# Altium schematic sheet Input_amplifiers.SchDoc: Input signal amplifiers
size A4; Date: 6.4.2015; Engineer: Matjaž Tome; Revision: B; SheetNumber: 7; SheetTotal: 10; Project: USB DAQ
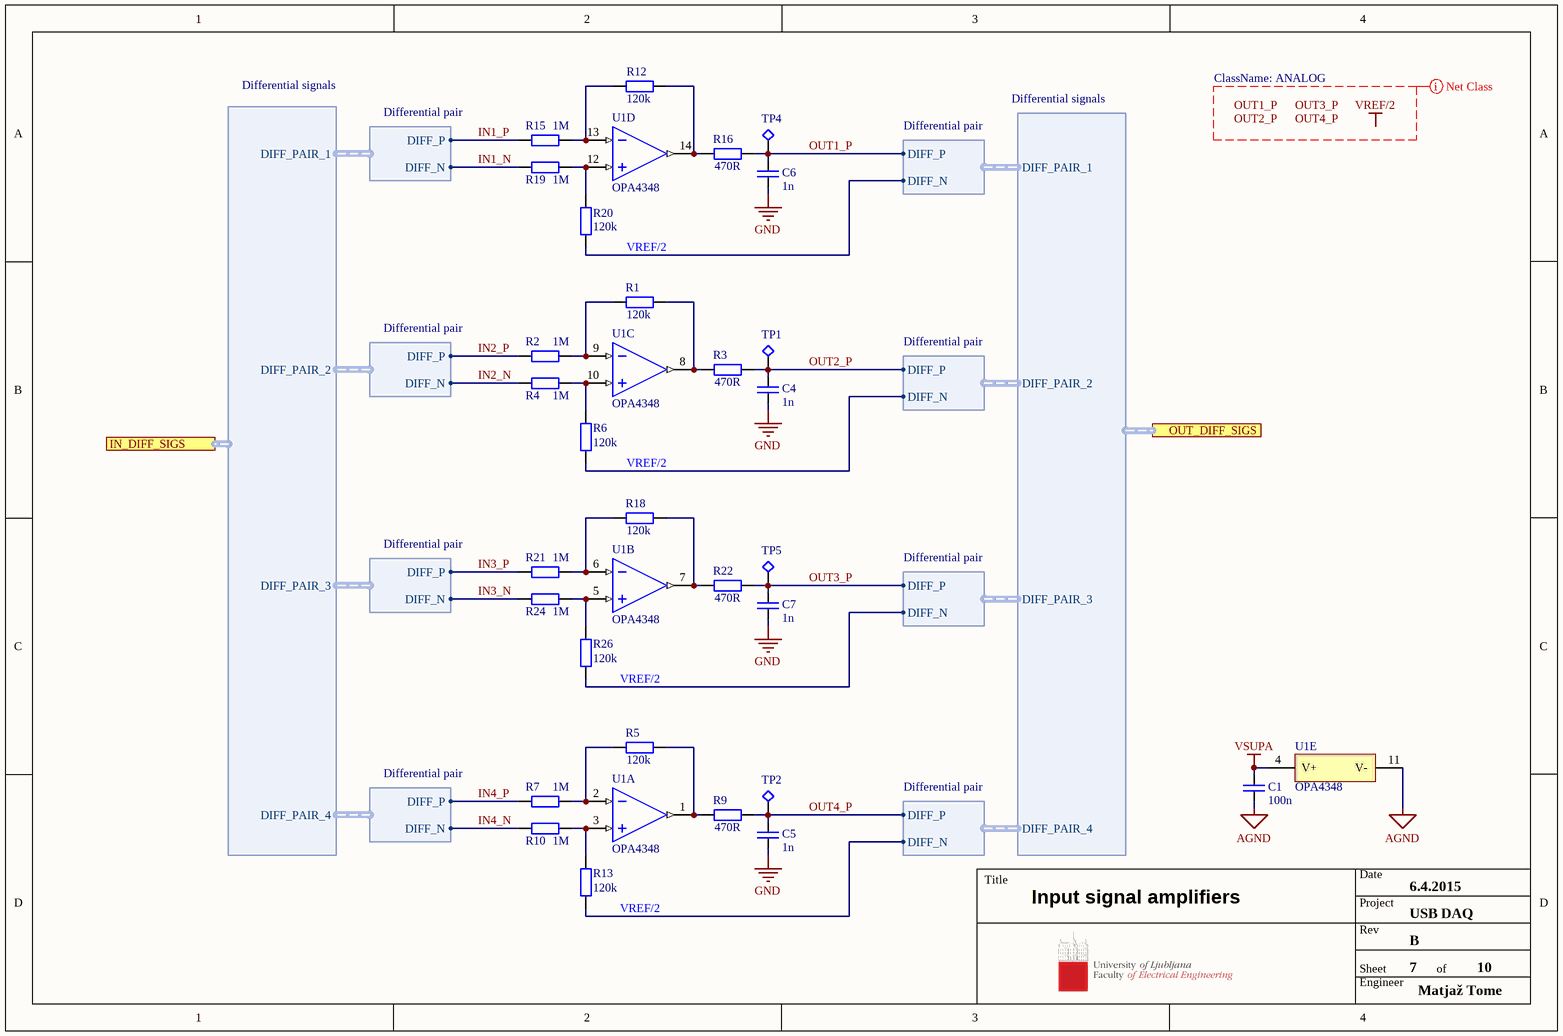
[diagram p0: Input_amplifiers.SchDoc]

## Parts
C1  value 100n  [C_0603]  (hidden comment: comment)
C4  value 1n  [C_0603]  (hidden comment: comment)
C5  value 1n  [C_0603]  (hidden comment: comment)
C6  value 1n  [C_0603]  (hidden comment: comment)
C7  value 1n  [C_0603]  (hidden comment: comment)
R1  value 120k  [R_0603]  (hidden comment: comment)
R2  value 1M  [R_0603]  (hidden comment: comment)
R3  value 470R  [R_0603]  (hidden comment: comment)
R4  value 1M  [R_0603]  (hidden comment: comment)
R5  value 120k  [R_0603]  (hidden comment: comment)
R6  value 120k  [R_0603]  (hidden comment: comment)
R7  value 1M  [R_0603]  (hidden comment: comment)
R9  value 470R  [R_0603]  (hidden comment: comment)
R10  value 1M  [R_0603]  (hidden comment: comment)
R12  value 120k  [R_0603]  (hidden comment: comment)
R13  value 120k  [R_0603]  (hidden comment: comment)
R15  value 1M  [R_0603]  (hidden comment: comment)
R16  value 470R  [R_0603]  (hidden comment: comment)
R18  value 120k  [R_0603]  (hidden comment: comment)
R19  value 1M  [R_0603]  (hidden comment: comment)
R20  value 120k  [R_0603]  (hidden comment: comment)
R21  value 1M  [R_0603]  (hidden comment: comment)
R22  value 470R  [R_0603]  (hidden comment: comment)
R24  value 1M  [R_0603]  (hidden comment: comment)
R26  value 120k  [R_0603]  (hidden comment: comment)
TP1  testpoint  [TP1_FULL]  (value not drawn)
TP2  testpoint  [TP1_FULL]  (value not drawn)
TP4  testpoint  [TP1_FULL]  (value not drawn)
TP5  testpoint  [TP1_FULL]  (value not drawn)
U1  OPA4348  [SOIC14]  (parts A,B,C,D,E of 5)

## Ports
IN_DIFF_SIGS (harness Differential signals), OUT_DIFF_SIGS (harness Differential signals)

## Harnesses
Differential signals: DIFF_PAIR_1, DIFF_PAIR_2, DIFF_PAIR_3, DIFF_PAIR_4
Differential pair: DIFF_P, DIFF_N

## Nets
AGND: C1.1 U1.11(V-)
GND: C4.2 C5.2 C6.2 C7.2
VSUPA: C1.2 U1.4(V+)
IN1_N: R19.1 ; harness Differential pair.DIFF_N
IN1_P: R15.1 ; harness Differential pair.DIFF_P
IN2_N: R4.1 ; harness Differential pair.DIFF_N
IN2_P: R2.1 ; harness Differential pair.DIFF_P
IN3_N: R24.1 ; harness Differential pair.DIFF_N
IN3_P: R21.1 ; harness Differential pair.DIFF_P
IN4_N: R10.1 ; harness Differential pair.DIFF_N
IN4_P: R7.1 ; harness Differential pair.DIFF_P
OUT1_P: C6.1 R16.2 TP4.1 ; harness Differential pair.DIFF_P
OUT2_P: C4.1 R3.2 TP1.1 ; harness Differential pair.DIFF_P
OUT3_P: C7.1 R22.2 TP5.1 ; harness Differential pair.DIFF_P
OUT4_P: C5.1 R9.2 TP2.1 ; harness Differential pair.DIFF_P
NetR1_1: R1.1 R2.2 U1.9(-IN_C)
NetR1_2: R1.2 R3.1 U1.8(OUT_C)
NetR4_2: R4.2 R6.2 U1.10(+IN_C)
NetR5_1: R5.1 R7.2 U1.2(-IN_A)
NetR5_2: R5.2 R9.1 U1.1(OUT_A)
NetR6_1: R6.1 ; harness Differential pair.DIFF_N
NetR10_2: R10.2 R13.2 U1.3(+IN_A)
NetR12_1: R12.1 R15.2 U1.13(-IN_D)
NetR12_2: R12.2 R16.1 U1.14(OUT_D)
NetR13_1: R13.1 ; harness Differential pair.DIFF_N
NetR18_1: R18.1 R21.2 U1.6(-IN_B)
NetR18_2: R18.2 R22.1 U1.7(OUT_B)
NetR19_2: R19.2 R20.2 U1.12(+IN_D)
NetR20_1: R20.1 ; harness Differential pair.DIFF_N
NetR24_2: R24.2 R26.2 U1.5(+IN_B)
NetR26_1: R26.1 ; harness Differential pair.DIFF_N

## Layout directives
net class ANALOG: OUT1_P, OUT2_P, OUT3_P, OUT4_P, VREF/2

## Notes on the sheet
- VREF/2
- (near R26) VREF/2
- (near R13) VREF/2
- Labels drawn without touching a wire or pin: OUT1_P, OUT2_P, OUT3_P, OUT4_P, VREF/2
- Title
- Date
- Project
- Rev
- Engineer
- Sheet
- of

## Library data of the parts
C1 C4-C7 = Capacitor: Generic capacitor
R1-R7 R9 R10 R12 R13 R15 R16 R18-R22 R24 R26 = Resistor: Generic resistor
TP1 TP2 TP4 TP5 = Test Point: testpoint 1.5mm diameter no hole; Part Number: XXC0006; Category: testpoints
U1 = OPA4348: 1MHz, 45µA, CMOS, Rail-to-Rail OPERATIONAL AMPLIFIERS Value Line Series; Part Number: XOG0008; Manufacturer: Texas Instruments; Manufacturer Number: OPA4348AID; Dealer number: 2323277; Dealer: Farnell; Supply voltage max: 5.5V; Supply voltage min: 2.1V; Devices: 4; Rail to Rail: IN/OUT; Category: Integrated circuits; Price: 1.64; GBP: 1MHz; Case: SOIC14; Technology: SMT; HelpURL: http://www.ti.com/general/docs/suppproductinfo.tsp?distId=26&gotoUrl=http%3A%2F%2Fwww.ti.com%2Flit%2Fgpn%2Fopa4348